# Altium schematic sheet pic32.SchDoc
size A4; SheetNumber: 1; SheetTotal: 3
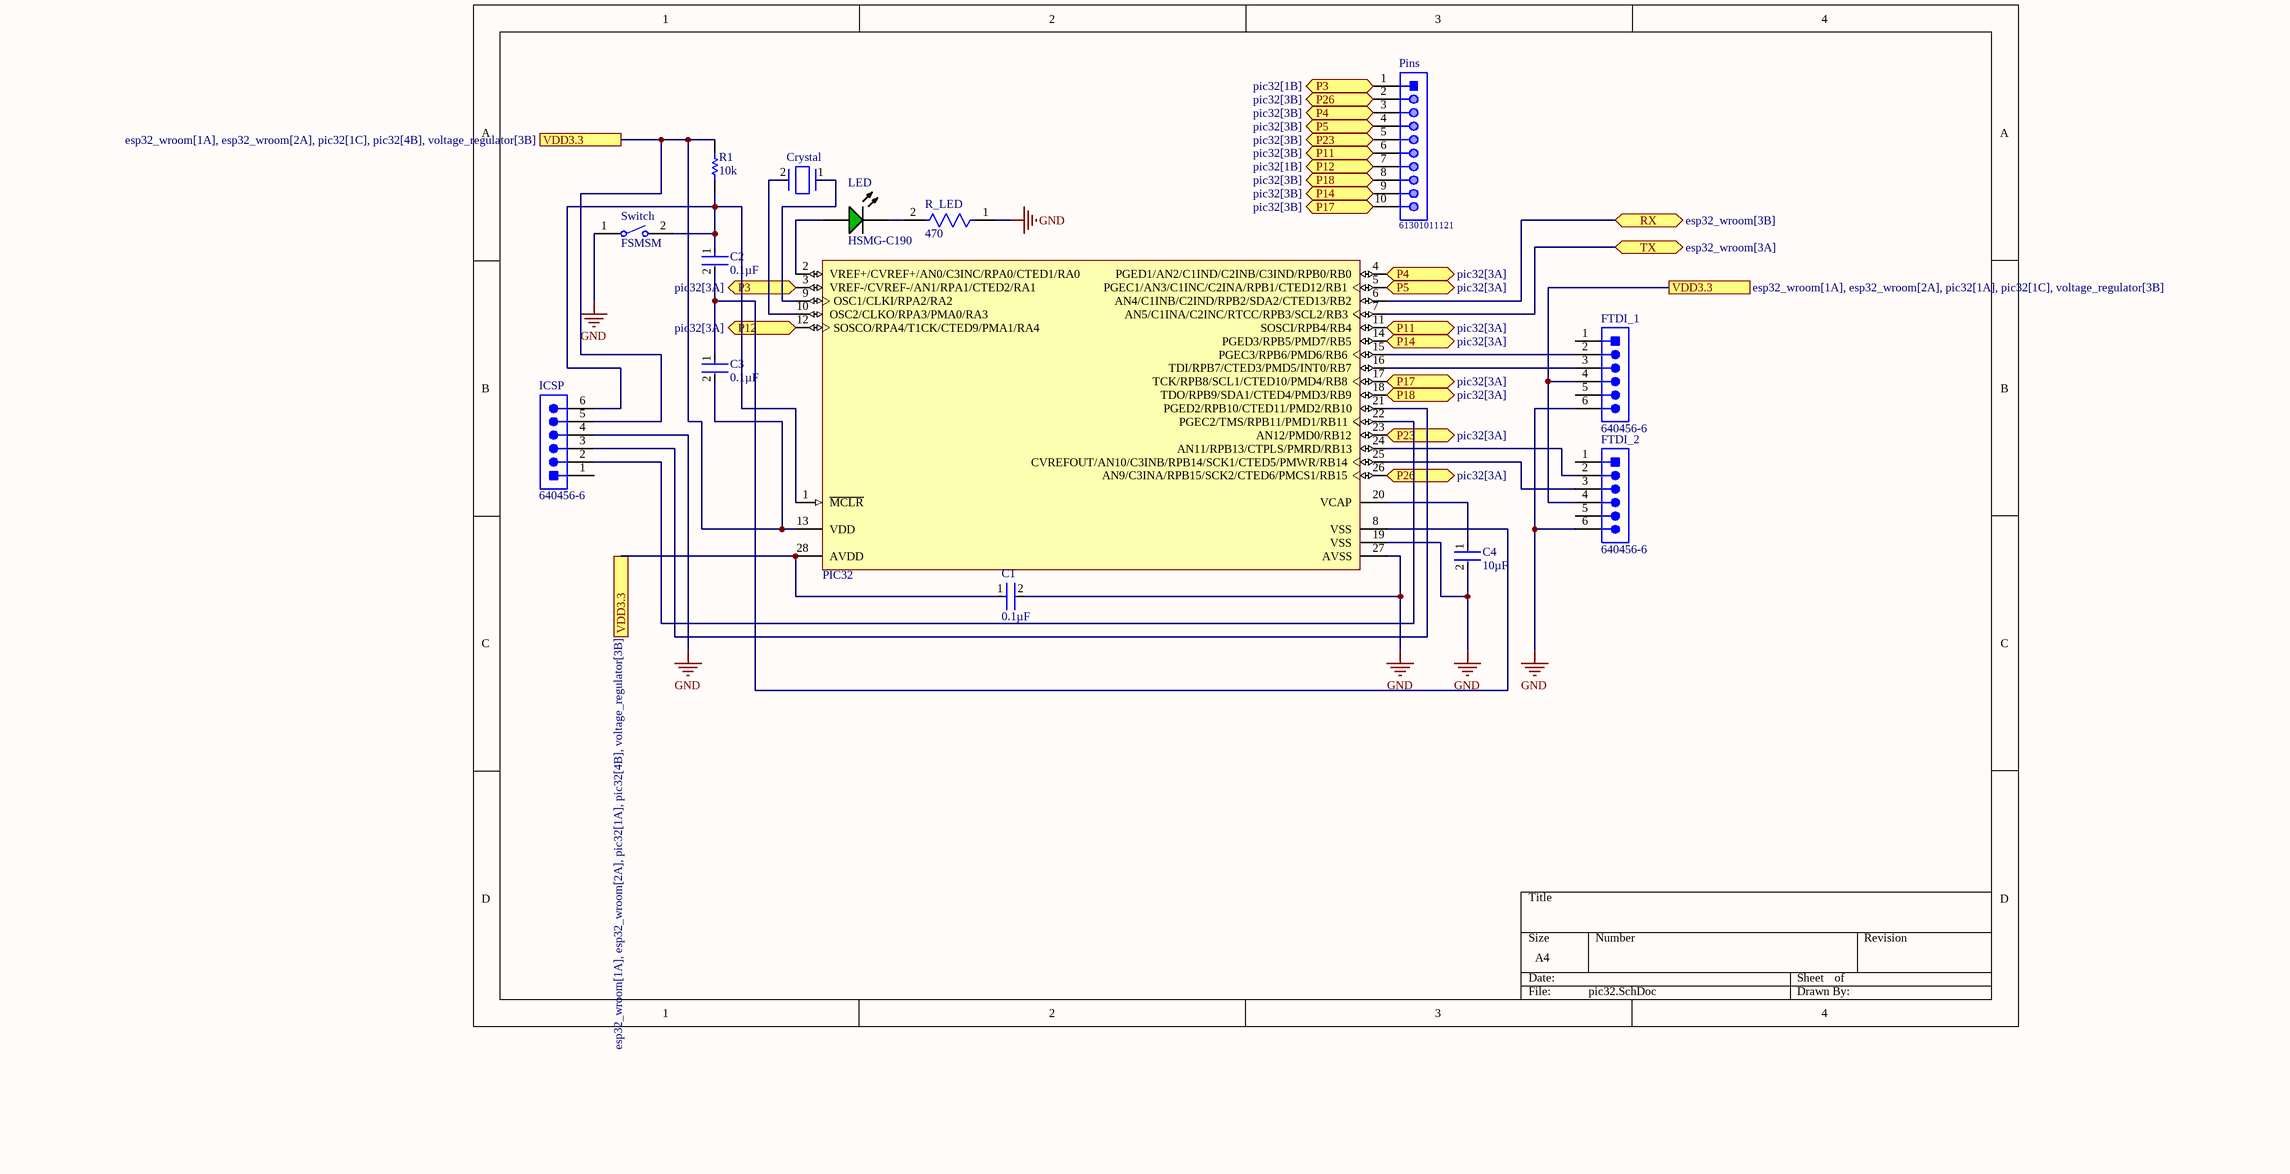
[diagram p0: pic32.SchDoc]

## Parts
C1  0.1µF  [FP-C0603C-CF-MFG]
C2  0.1µF  [FP-C0603C-CF-MFG]
C3  0.1µF  [FP-C0603C-CF-MFG]
C4  10µF  [FP-GRM188-0_1-e0_2_0_55-MFG]
Crystal  (no value)  [FP-ABLS-MFG]
FTDI_1  640456-6  [TECO-640456-6_V]
FTDI_2  640456-6  [TECO-640456-6_V]
ICSP  640456-6  [TECO-640456-6_V]
LED  HSMG-C190  [AVAG-HSMX-C190_V]
PIC32  PIC32MX150F128B-I/SP  [MCHP-SPDIP-SP28]  (value not drawn)
Pins  61301011121  [61301011121]
R1  10k  [RESC1608X55X25ML10T15]
R_LED  470  [FP-CR0402-MFG]
Switch  FSMSM  [TECO-FSMSM-2_V]

## Ports
P3 (bidir, see pic32[1B]), P3 (bidir, see pic32[3A]), P4 (bidir, see pic32[3A]), P4 (bidir, see pic32[3B]), P5 (bidir, see pic32[3A]), P5 (bidir, see pic32[3B]), P11 (bidir, see pic32[3A]), P11 (bidir, see pic32[3B]), P12 (bidir, see pic32[1B]), P12 (bidir, see pic32[3A]), P14 (bidir, see pic32[3A]), P14 (bidir, see pic32[3B]), P17 (bidir, see pic32[3A]), P17 (bidir, see pic32[3B]), P18 (bidir, see pic32[3A]), P18 (bidir, see pic32[3B]), P23 (bidir, see pic32[3A]), P23 (bidir, see pic32[3B]), P26 (bidir, see pic32[3A]), P26 (bidir, see pic32[3B]), RX (bidir, see esp32_wroom[3B]), TX (bidir, see esp32_wroom[3A]), VDD3.3 (see esp32_wroom[1A], esp32_wroom[2A], pic32[1A], pic32[1C], voltage_regulator[3B]), VDD3.3 (see esp32_wroom[1A], esp32_wroom[2A], pic32[1A], pic32[4B], voltage_regulator[3B]), VDD3.3 (see esp32_wroom[1A], esp32_wroom[2A], pic32[1C], pic32[4B], voltage_regulator[3B])

## Nets
GND: C1.2 C4.2 FTDI_1.6 FTDI_2.6 ICSP.4 PIC32.19(VSS) PIC32.27(AVSS) R_LED.1 Switch.1
P3: PIC32.3(VREF-/CVREF-/AN1/RPA1/CTED2/RA1) Pins.1 ; port P3
P4: PIC32.4(PGED1/AN2/C1IND/C2INB/C3IND/RPB0/RB0) Pins.3 ; port P4
P5: PIC32.5(PGEC1/AN3/C1INC/C2INA/RPB1/CTED12/RB1) Pins.4 ; port P5
P11: PIC32.11(SOSCI/RPB4/RB4) Pins.6 ; port P11
P12: PIC32.12(SOSCO/RPA4/T1CK/CTED9/PMA1/RA4) Pins.7 ; port P12
P14: PIC32.14(PGED3/RPB5/PMD7/RB5) Pins.9 ; port P14
P17: PIC32.17(TCK/RPB8/SCL1/CTED10/PMD4/RB8) Pins.10 ; port P17
P18: PIC32.18(TDO/RPB9/SDA1/CTED4/PMD3/RB9) Pins.8 ; port P18
P23: PIC32.23(AN12/PMD0/RB12) Pins.5 ; port P23
P26: PIC32.26(AN9/C3INA/RPB15/SCK2/CTED6/PMCS1/RB15) Pins.2 ; port P26
RX: PIC32.6(AN4/C1INB/C2IND/RPB2/SDA2/CTED13/RB2) ; port RX
TX: PIC32.7(AN5/C1INA/C2INC/RTCC/RPB3/SCL2/RB3) ; port TX
VDD3.3: C1.1 C3.2 FTDI_1.4 FTDI_2.4 ICSP.5 PIC32.13(VDD) PIC32.28(AVDD) R1.2 ; port VDD3.3
NetC2_1: C2.1 ICSP.6 PIC32.1(~{MCLR}) R1.1 Switch.2
NetC2_2: C2.2 C3.1 PIC32.8(VSS)
NetC4_1: C4.1 PIC32.20(VCAP)
NetCrystal_1: Crystal.1 PIC32.9(OSC1/CLKI/RPA2/RA2)
NetCrystal_2: Crystal.2 PIC32.10(OSC2/CLKO/RPA3/PMA0/RA3)
NetFTDI_1_2: FTDI_1.2 PIC32.15(PGEC3/RPB6/PMD6/RB6)
NetFTDI_1_3: FTDI_1.3 PIC32.16(TDI/RPB7/CTED3/PMD5/INT0/RB7)
NetFTDI_2_2: FTDI_2.2 PIC32.24(AN11/RPB13/CTPLS/PMRD/RB13)
NetFTDI_2_3: FTDI_2.3 PIC32.25(CVREFOUT/AN10/C3INB/RPB14/SCK1/CTED5/PMWR/RB14)
NetICSP_2: ICSP.2 PIC32.22(PGEC2/TMS/RPB11/PMD1/RB11)
NetICSP_3: ICSP.3 PIC32.21(PGED2/RPB10/CTED11/PMD2/RB10)
NetLED_1: LED.1(A) PIC32.2(VREF+/CVREF+/AN0/C3INC/RPA0/CTED1/RA0)
NetLED_2: LED.2(K) R_LED.2

Not connected (* = marked no-connect by the designer): FTDI_1 1 5; FTDI_2 1 5; ICSP 1

## Library data of the parts
C1-C3 = CMP-2006-03061-2: CAP CER 0.1UF 50V X7R 0603 / C0603C104K5RACTU; Manufacturer: KEMET; Tolerance: 0.1; Temperature Coefficient: 30ppm/°C; Material: Ceramic; Automotive Grade: Grade 1; Value: 0.10 μF; Temperature: -55°C to +125°C; RoHS: TRUE; Temperature Range High: +125°C; Lead Free: Yes; Octopart: https://octopart.com/c0603c104k5ractu-kemet-139244; Digikey Description: CAP CER 0.1UF 50V X7R 0603; Category: Cap; Package: C0603C-CF; ComponentLink2Description: Datasheet; Temperature Range Low: -55°C; Device Class L1: Passive Components; Voltage Rating: 50 V; Automotive: Yes; Device Class L3: Ceramic Capacitors; ComponentLink2URL: https://api.kemet.com/component-edge/download/datasheet/C0603C100J5GACAUTO.pdf; Capacitance: 0.10 μF; Device Class L2: Capacitors; Manufacturer Part Number: C0603C104K5RACTU; Temperature Characteristic: X7R; Height: 0.87mm
C4 = CMP-2006-02793-3: Chip Multilayer Ceramic Capacitors for General Purpose, 0603, 10uF, X5R, 15%, 20%, 6.3V / GRM188R60J106ME47J; Packaging: Tape and Reel; Max Operating Temperature: 85°C; Voltage Rating: 6.3V; Voltage Rating (DC): 6.3V; Voltage: 6.3V; Package Quantity: 10000; Width: 0.8mm; Min Operating Temperature: -55°C; Capacitance: 10uF; Tolerance: 20%; REACH SVHC: No SVHC; Termination: SMD/SMT; Radiation Hardening: No; Lead Free: Lead Free; Dielectric: X5R; Depth: 0.8mm; Mount: Surface Mount; Case Code (Imperial): 0603; Height: 0.8mm; Thickness: 0.035inch; Length: 1.6mm; Case Code (Metric): 1608; Case/Package: 0603
Crystal = CMP-27762-000003-1: CRYSTAL 16.0000MHZ 18PF SMD / ABLS-16.000MHZ-K4T; Manufacturer: Abracon; Frequency: 16MHz; Stability: 50ppm; Tolerance: 30ppm; Standoff Height: 0mm; Esr: 40Ω; ComponentLink2URL: https://abracon.com/Resonators/abls.pdf; Temperature Range High: +125°C; Package: ABLS; Device Class L3: Crystals; Temperature: -40°C to +125°C; Load Capacitance: 18pF; Device Class L2: Crystals / Oscillators; Mouser Description: Crystal 16MHz ±30ppm (Tol) ±50ppm (Stability) 18pF FUND 40Ohm 2-Pin HC-49/US SMD T/R; Category: Crys; ComponentLink2Description: Datasheet; Manufacturer Part Number: ABLS-16.000MHZ-K4T; Series: ABLS; Automotive: No; Octopart: https://octopart.com/abls-16.000mhz-k4t-abracon-18618626; RoHS: TRUE; Digikey Description: CRYSTAL 16.0000MHZ 18PF SMD; Temperature Range Low: -40°C; Lead Free: Yes; Height: 4.3mm; Device Class L1: Passive Components
FTDI_1 FTDI_2 ICSP = CMP-2000-05661-1: Male Header, Pitch 2.54 mm, 1 x 6 Position, Height 10.03 mm, Tail Length 3.56 mm, -55 to 105 degC, Bulk; Manufacturer: TE Connectivity; Contact Centerline Spacing: 0.100 / in.; Number of Contacts: 6; Current, Rating: 5 / A; Agency Approvals: CSA,UL; Material, Contact: CopperAlloy; Mounting Hole Size: 0.04 / "; Brand/Series: MTA-100Series; Pin Spacing: 0.1 / "; Mount Angle: Vertical; Contact Termination Area Plating: Tin; Angle: Straight; Primary Type: InterconnectSystem; Standards: RoHSCompliant,ELVCompliant,UL94V-0; Temperature, Operating: -55to+105 / °C; Material, Housing: Polyester; Special Features: Pinstrip; Color, Housing: White; Connector Type: MTA-100; Voltage, Rating: 250 / V; Termination: Solder; Package Reference: 640456-6; Size, Post: 0.025 / in.; Color: White; Datasheet URL: https://datasheet.ciiva.com/25618/0900766b80eb7fdd-25618163.pdf; Manufacturer URL: http://www.te.com/; Mounting Type: PCMount; Length, Pin: 0.14 / "; Type: PCBPlug; Length, Overall: 0.6 / "; Mounting Technology: ThroughHole; Number of Rows: 1; Contact Shape: Square; Contact Mating Area Plating: Tin; Datasheet Version: Rev. W, 05/2005; Number of Positions: 6; Package Description: Male Header, Pitch 2.54 mm, 1 x 6 Position, Height 10.03 mm, Tail Length 3.56 mm; Contact Plating: Tin; Length, Terminal Post: 0.14 / in.; Flammability Rating: UL94V-0
LED = CMP-1744-00002-1: Chip LED, Green, 2.2 V, -40 to 85 degC, 2-Pin SMD, RoHS, Tape and Reel / HSMG-C190; Frequency: 400 KHz; Max Supply Voltage: 5.5 V; Access Time: 3500 ns; Clock Frequency: 100 KHz; Case\Package: SOIC; Density: 32 kb; Nominal Supply Current: 2 mA; Interface: Serial; Min Supply Voltage: 1.7 V; Packaging: Tape and Reel; PackageReference: HSMX-C190; ComponentLink2URL: http://docs.avagotech.com/docs/AV02-0551EN; RoHSCompliant: true; Pins: 8; REACH SVHC: No SVHC; Max Operating Temperature: 85 degC; Width: 4 mm; Radiation Hardening: No; Package Quantity: 3000; ComponentLink3Description: Package Specification; ComponentLink1Description: Manufacturer URL; Min Operating Temperature: -40 degC; PackageDescription: 2-Pin Surface Mount Device, Body 1.6 x 0.8 mm, Height 0.9 mm; Max Clock Frequency: 100 KHz; Height: 1.5 mm; ComponentLink1URL: http://www.avagotech.com/; DatasheetVersion: Mar-12; ComponentLink2Description: Datasheet; Mount: Surface Mount; Length: 5 mm; ComponentLink3URL: http://www.fairchildsemi.com/dwg/MA/MA03D.pdf
PIC32 = CMP-0048-00469-1: 32-bit Microcontroller with Audio and Graphics Interface, USB and Advanced Analog, 50 MHz, 21 I/O, PMP, -40 to 85 degC, 28-pin SPDIP (SP28), Tube; Manufacturer: Microchip; DatasheetVersion: Rev. E; ComponentLink1URL: http://www.microchip.com; ComponentLink3URL: http://www.microchip.com/stellent/groups/techpub_sg/documents/packagingspec/en012702.pdf; ComponentLink4URL: http://www.microchip.com/PIC32MX150F128B; PartNumber: PIC32MX150F128B-I/SP; ComponentLink3Description: Package Specification; ComponentLink2URL: http://ww1.microchip.com/downloads/en/DeviceDoc/61168E.pdf; ComponentLink2Description: Datasheet; PackageDescription: 28-Lead Plastic Dual In-Line, 34.86 x 6.79 mm Body, 2.54 mm Pitch; ComponentLink1Description: Manufacturer URL; PackageReference: SPDIP-SP28; PackageVersion: C04-070B; ComponentLink4Description: Product URL; Mounting Technology: Through Hole
Pins = CMP-1502-01082-1: THT Vertical Pin Header WR-PHD, Pitch 2.54 mm, Single Row, 10 pins; Manufacturer: Wurth Elektronik; Contact Resistance: 20mOhm; Rated Current: 3A; Pitch: 2.54mm; Gender: Male; Pin Number: 10; Working Voltage: 250VAC; Withstanding Voltage: 500VAC; Manufacturer URL: http://www.we-online.de; Operating Temperature: -40to105degC; Datasheet URL: https://katalog.we-online.de/em/datasheet/6130xx11121.pdf; Row Number: Single; Orientation: Vertical; Part Number: 61301011121; Packaging: Bag; Package Reference: 61301011121; Mounting Technology: THT; Publisher: WurthElektronik
R1 = CMP-2100-03664-1: Chip Resistor, 10 KOhm, +/- 1%, 01 W, -55 to 155 degC, 0603 (1608 Metric), RoHS, Tape and Reel / RC0603FR-0710KL; Manufacturer: Yageo; Temperature Coefficient: 100ppm/degreesC; Resistance: 10KOhm; Voltage Rating: 75V; Power Rating: 100mW; Voltage Rating (DC): 50V; Composition: ThickFilm; RoHSCompliant: true; Height: 0.45mm; Lead Free: LeadFree; Case Code (Metric): 1608; Case/Package: 0603; Datasheet Version: Rev. 5, 10/2016; Package Reference: 0603; Depth: 0.8mm; Package Description: 2-Pin Surface Mount Device, Body 1.6 x 0.8 mm; Case Code (Imperial): 0603; Packaging: TapeandReel; Termination: SMD/SMT; Lead Pitch: 0.3mm; Width: 0.8mm; Number of Pins: 2; Length: 1.6mm; REACH SVHC: NoSVHC; Military Standard: Not; Max Operating Temperature: 155degC; Min Operating Temperature: -55degC; Manufacturer URL: http://www.yageo.com/; Datasheet URL: http://www.yageo.com/NewPortal/yageodocoutput?fileName=/pdf/R-Chip/PYu-RC_Group_51_RoHS_L_5.pdf; Weight: 7.1E-05oz; Tolerance: 1%
R_LED = CMP-1011-00473-3: Thick Film Chip Resistors 0402 470Ω 0.0625W 1% 100ppm/°C / CR0402-FX-4700GLF; Voltage Rating: 50V; Max Power Dissipation: 63mW; Resistance: 470R; Power Rating: 62.5mW; Mount: Surface Mount; Thickness: 356um; Length: 1mm; Depth: 0.5mm; Tolerance: 1%; Contact Plating: Tin; Height: 0.016inch; Max Operating Temperature: 125°C; Military Standard: Not; Composition: Thick Film; Package Quantity: 10000; Case Code (Imperial): 0402; Temperature Coefficient: 100ppm/°C; Radiation Hardening: No; Width: 0.02inch; Min Operating Temperature: -55°C; Case Code (Metric): 1005; Number of Terminations: 2; Case/Package: 0402; Termination: SMD/SMT; Packaging: Tape and Reel
Switch = CMP-2000-07511-1: FSMSM Push Button Switch, 50 mA, -35 to 85 degC, 2-Pin SMD, RoHS, Bulk; Manufacturer: TE Connectivity; Actuator Length: 1.07mm; Electrical Life: 20000Cycles; Actuator Material: Polyamide; Current Rating: 50mA; Illumination Type: Illuminated; Voltage Rating (DC): 24V; Contact Resistance: 100mOhm; Case\/Package: SMD/SMT; Operating Force: 180gf; Switch Travel: 0.25mm; Max Voltage Rating (DC): 12V; Throw Configuration: SPST; Packaging: LoosePiece; Max Operating Temperature: 85degC; ELV: Compliant; Package Description: 2-Pin Surface Mount Device, Body 6 x 3.5 mm, Pitch 9.19 mm; RoHSCompliant: true; Manufacturer URL: http://www.te.com/; Contact Plating: Silver; Contact Material: Brass; Mounting Technology: SurfaceMount; Contact Current Rating: 50mA; Datasheet Version: Rev. C2, 08/2014; Datasheet URL: http://www.te.com/commerce/DocumentDelivery/DDEController?Action=showdoc&DocId=Customer+Drawing%7F1437566-3%7FC2%7Fpdf%7FEnglish%7FENG_CD_1437566-3_C2_1437566_3_1_c.dwg.pdf%7F1437566-3; Mechanical Life: 20000Cycles; Package Reference: FSMSM; REACH SVHC: Unknown; Orientation: Straight; Min Operating Temperature: -35degC; Lead Free: LeadFree; Termination: GullWing; Package Quantity: 1000; Mount: SurfaceMount